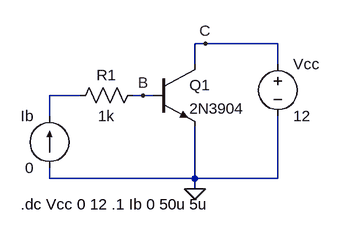
[diagram p0: schematic plt1.asc]
plt1.asc, the LTspice schematic file:
Version 4
SHEET 1 880 680
WIRE 288 32 272 32
WIRE 400 32 288 32
WIRE 272 64 272 32
WIRE 400 64 400 32
WIRE 96 112 48 112
WIRE 192 112 176 112
WIRE 208 112 192 112
WIRE 48 144 48 112
WIRE 48 240 48 224
WIRE 272 240 272 160
WIRE 272 240 48 240
WIRE 400 240 400 144
WIRE 400 240 272 240
WIRE 272 256 272 240
FLAG 272 256 0
FLAG 288 32 C
FLAG 192 112 B
SYMBOL res 192 96 R90
WINDOW 0 0 56 VBottom 2
WINDOW 3 32 56 VTop 2
SYMATTR InstName R1
SYMATTR Value 1k
SYMBOL npn 208 64 R0
SYMATTR InstName Q1
SYMATTR Value 2N3904
SYMBOL voltage 400 48 R0
WINDOW 123 0 0 Left 0
WINDOW 39 0 0 Left 0
SYMATTR InstName Vcc
SYMATTR Value 12
SYMBOL current 48 224 R180
WINDOW 0 24 80 Left 2
WINDOW 3 24 0 Left 2
WINDOW 123 0 0 Left 0
WINDOW 39 0 0 Left 0
SYMATTR InstName Ib
SYMATTR Value 0
TEXT 4 280 Left 2 !.dc Vcc 0 12 .1 Ib 0 50u 5u

The netlist it stands for:
* plt1.asc
R1 B N001 1k
Q1 C B 0 0 2N3904
Vcc C 0 12
Ib 0 N001 0
.model NPN NPN
.model PNP PNP
.lib standard.bjt
.dc Vcc 0 12 .1 Ib 0 50u 5u
.backanno
.end